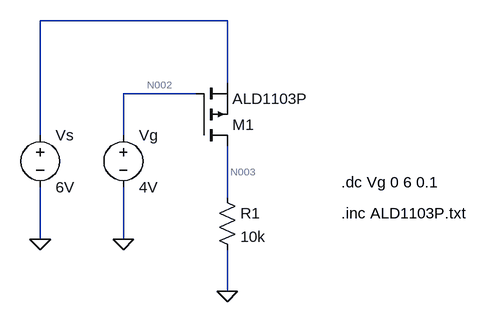
[diagram p0: schematic Exp4 - PMOS.asc]
Exp4 - PMOS.asc, the LTspice schematic file:
Version 4.1
SHEET 1 880 680
WIRE 288 -112 0 -112
WIRE 288 -16 288 -112
WIRE 240 0 128 0
WIRE 0 64 0 -112
WIRE 128 64 128 0
WIRE 288 160 288 80
WIRE 0 224 0 144
WIRE 128 224 128 144
WIRE 288 304 288 240
FLAG 0 224 0
FLAG 128 224 0
FLAG 288 304 0
SYMBOL res 272 144 R0
SYMATTR InstName R1
SYMATTR Value 10k
SYMBOL pmos 240 80 M180
SYMATTR InstName M1
SYMATTR Value ALD1103P
SYMBOL voltage 0 48 R0
SYMATTR InstName Vs
SYMATTR Value 6V
SYMBOL voltage 128 48 R0
SYMATTR InstName Vg
SYMATTR Value 4V
TEXT 464 184 Left 2 !.inc ALD1103P.txt
TEXT 464 136 Left 2 !.dc Vg 0 6 0.1

The netlist it stands for:
* Exp4 - PMOS.asc
R1 N003 0 10k
M1 N003 N002 N001 N001 ALD1103P
Vs N001 0 6V
Vg N002 0 4V
.model NMOS NMOS
.model PMOS PMOS
.lib standard.mos
.inc ALD1103P.txt
.dc Vg 0 6 0.1
.backanno
.end

* Results of the author's LTspice run, read from the files saved beside the schematic
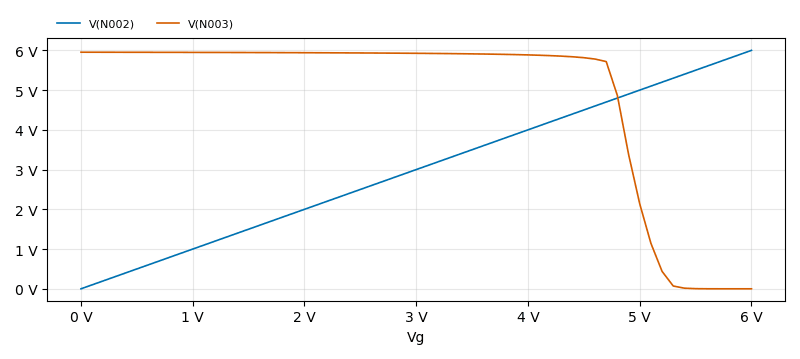
[diagram p1: DC transfer characteristic of Exp4 - PMOS.asc, plotted from the saved traces]
* DC transfer characteristic, 1 run:
*   V(N002): 0 V at Vg=0 V, 6 V at Vg=6 V, min 0 V, max 6 V
*   V(N003): 5.954 V at Vg=0 V, 1.815 µV at Vg=6 V, min 1.815 µV, max 5.954 V